# Altium schematic sheet SCH12_AFE.SchDoc: Beaglebone Black - AFE
size B; Organization: CWRUbotix; Address1: 10900 Euclid Avenue; Address2: Cleveland, OH 44106; Address3: USA; Revision: 1.0; SheetNumber: 12; SheetTotal: 13
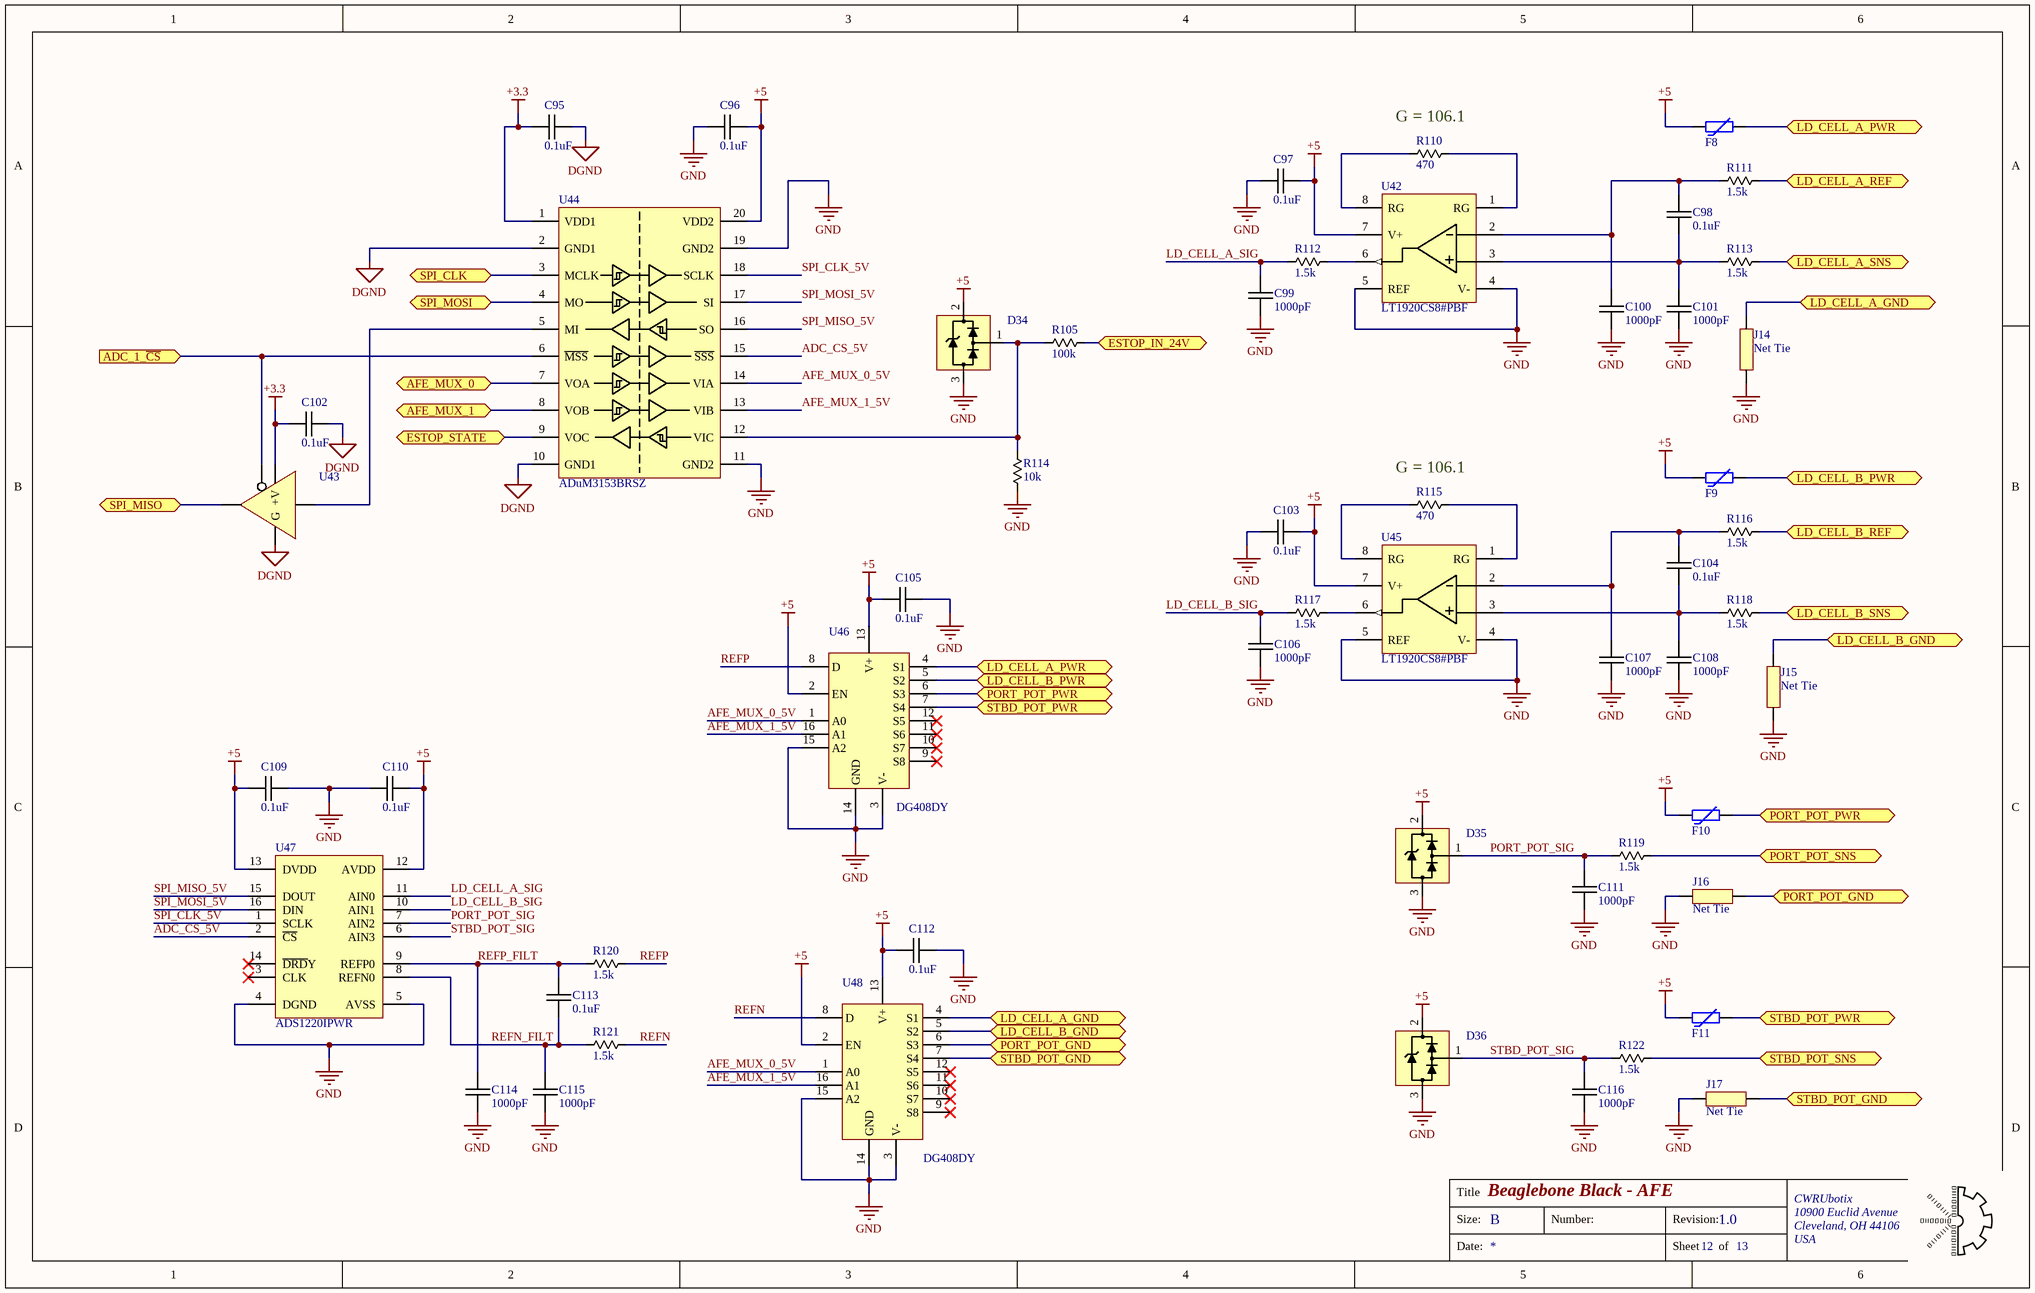
[diagram p0: SCH12_AFE.SchDoc]

## Parts
C95  0.1uF  [chip_0603]
C96  0.1uF  [chip_0603]
C97  0.1uF  [chip_0603]
C98  0.1uF  [chip_0603]
C99  1000pF  [chip_0603]
C100  1000pF  [chip_0603]
C101  1000pF  [chip_0603]
C102  0.1uF  [chip_0603]
C103  0.1uF  [chip_0603]
C104  0.1uF  [chip_0603]
C105  0.1uF  [chip_0603]
C106  1000pF  [chip_0603]
C107  1000pF  [chip_0603]
C108  1000pF  [chip_0603]
C109  0.1uF  [chip_0603]
C110  0.1uF  [chip_0603]
C111  1000pF  [chip_0603]
C112  0.1uF  [chip_0603]
C113  0.1uF  [chip_0603]
C114  1000pF  [chip_0603]
C115  1000pF  [chip_0603]
C116  1000pF  [chip_0603]
D34  DLPT05  [sot-23-3]  (value not drawn)
D35  DLPT05  [sot-23-3]  (value not drawn)
D36  DLPT05  [sot-23-3]  (value not drawn)
F8  PTC_0  [chip_1206]  (value not drawn)
F9  PTC_0  [chip_1206]  (value not drawn)
F10  PTC_0  [chip_1206]  (value not drawn)
F11  PTC_0  [chip_1206]  (value not drawn)
J14  Net Tie  [net_tie_0]
J15  Net Tie  [net_tie_0]
J16  Net Tie  [net_tie_0]
J17  Net Tie  [net_tie_0]
R105  100k  [chip_0603]
R110  470  [chip_0805]
R111  1.5k  [chip_0603]
R112  1.5k  [chip_0603]
R113  1.5k  [chip_0603]
R114  10k  [chip_0603]
R115  470  [chip_0805]
R116  1.5k  [chip_0603]
R117  1.5k  [chip_0603]
R118  1.5k  [chip_0603]
R119  1.5k  [chip_0603]
R120  1.5k  [chip_0603]
R121  1.5k  [chip_0603]
R122  1.5k  [chip_0603]
U42  LT1920CS8#PBF  [SO-8_1]
U43  SN74AHCT1G125  [sot-23-5]  (value not drawn)
U44  ADuM3153BRSZ  [tssop-20_1]
U45  LT1920CS8#PBF  [SO-8_1]
U46  DG408DY  [SO-16_1]
U47  ADS1220IPWR  [TSSOP-16_0_1]
U48  DG408DY  [SO-16_1]

## Ports
ADC_1_~{CS} (in), AFE_MUX_0 (bidir), AFE_MUX_1 (bidir), ESTOP_IN_24V (bidir), ESTOP_STATE (bidir), LD_CELL_A_GND (bidir), LD_CELL_A_PWR (bidir), LD_CELL_A_REF (bidir), LD_CELL_A_SNS (bidir), LD_CELL_B_GND (bidir), LD_CELL_B_PWR (bidir), LD_CELL_B_REF (bidir), LD_CELL_B_SNS (bidir), PORT_POT_GND (bidir), PORT_POT_PWR (bidir), PORT_POT_SNS (bidir), SPI_CLK (bidir), SPI_MISO (bidir), SPI_MOSI (bidir), STBD_POT_GND (bidir), STBD_POT_PWR (bidir), STBD_POT_SNS (bidir)

## Nets
+3.3: C95.2 C102.2 U43.5(+V) U44.1(VDD1)
+5: C96.1 C97.1 C103.1 C105.2 C109.2 C110.1 C112.2 D34.2(VCC) D35.2(VCC) D36.2(VCC) F8.1 F9.1 F10.1 F11.1 U42.7(V+) U44.20(VDD2) U45.7(V+) U46.2(EN) U46.13(V+) U47.12(AVDD) U47.13(DVDD) U48.2(EN) U48.13(V+)
DGND: C95.1 C102.1 U43.3(G) U44.2(GND1) U44.10(GND1)
GND: C96.2 C97.2 C99.2 C100.2 C101.2 C103.2 C105.1 C106.2 C107.2 C108.2 C109.1 C110.2 C111.2 C112.1 C114.2 C115.2 C116.2 D34.3(GND) D35.3(GND) D36.3(GND) J14.1(NET1) J15.1(NET1) J16.1(NET1) J17.1(NET1) R114.2 U42.4(V-) U42.5(REF) U44.11(GND2) U44.19(GND2) U45.4(V-) U45.5(REF) U46.3(V-) U46.14(GND) U46.15(A2) U47.4(DGND) U47.5(AVSS) U48.3(V-) U48.14(GND) U48.15(A2)
ADC_1_~{CS}: U43.1(~{OE}) U44.6(~{MSS}) ; port ADC_1_~{CS}
ADC_CS_5V: U44.15(~{SSS}) U47.2(~{CS})
AFE_MUX_0: U44.7(VOA) ; port AFE_MUX_0
AFE_MUX_0_5V: U44.14(VIA) U46.1(A0) U48.1(A0)
AFE_MUX_1: U44.8(VOB) ; port AFE_MUX_1
AFE_MUX_1_5V: U44.13(VIB) U46.16(A1) U48.16(A1)
ESTOP_IN_24V: R105.2 ; port ESTOP_IN_24V
ESTOP_STATE: U44.9(VOC) ; port ESTOP_STATE
LD_CELL_A_GND: J14.2(NET2) U48.4(S1) ; port LD_CELL_A_GND
LD_CELL_A_PWR: F8.2 U46.4(S1) ; port LD_CELL_A_PWR
LD_CELL_A_REF: R111.2 ; port LD_CELL_A_REF
LD_CELL_A_SIG: C99.1 R112.1 U47.11(AIN0)
LD_CELL_A_SNS: R113.2 ; port LD_CELL_A_SNS
LD_CELL_B_GND: J15.2(NET2) U48.5(S2) ; port LD_CELL_B_GND
LD_CELL_B_PWR: F9.2 U46.5(S2) ; port LD_CELL_B_PWR
LD_CELL_B_REF: R116.2 ; port LD_CELL_B_REF
LD_CELL_B_SIG: C106.1 R117.1 U47.10(AIN1)
LD_CELL_B_SNS: R118.2 ; port LD_CELL_B_SNS
PORT_POT_GND: J16.2(NET2) U48.6(S3) ; port PORT_POT_GND
PORT_POT_PWR: F10.2 U46.6(S3) ; port PORT_POT_PWR
PORT_POT_SIG: C111.1 D35.1(LINE) R119.1 U47.7(AIN2)
PORT_POT_SNS: R119.2 ; port PORT_POT_SNS
REFN: R121.2 U48.8(D)
REFN_FILT: C113.2 C115.1 R121.1 U47.8(REFN0)
REFP: R120.2 U46.8(D)
REFP_FILT: C113.1 C114.1 R120.1 U47.9(REFP0)
SPI_CLK: U44.3(MCLK) ; port SPI_CLK
SPI_CLK_5V: U44.18(SCLK) U47.1(SCLK)
SPI_MISO: U43.4(Y) ; port SPI_MISO
SPI_MISO_5V: U44.16(SO) U47.15(DOUT)
SPI_MOSI: U44.4(MO) ; port SPI_MOSI
SPI_MOSI_5V: U44.17(SI) U47.16(DIN)
STBD_POT_GND: J17.2(NET2) U48.7(S4) ; port STBD_POT_GND
STBD_POT_PWR: F11.2 U46.7(S4) ; port STBD_POT_PWR
STBD_POT_SIG: C116.1 D36.1(LINE) R122.1 U47.6(AIN3)
STBD_POT_SNS: R122.2 ; port STBD_POT_SNS
NetC98_1: C98.1 C100.1 R111.1 U42.2(-IN)
NetC98_2: C98.2 C101.1 R113.1 U42.3(+IN)
NetC104_1: C104.1 C107.1 R116.1 U45.2(-IN)
NetC104_2: C104.2 C108.1 R118.1 U45.3(+IN)
NetD34_1: D34.1(LINE) R105.1 R114.1 U44.12(VIC)
NetR110_1: R110.1 U42.8(RG)
NetR110_2: R110.2 U42.1(RG)
NetR112_2: R112.2 U42.6(OUT)
NetR115_1: R115.1 U45.8(RG)
NetR115_2: R115.2 U45.1(RG)
NetR117_2: R117.2 U45.6(OUT)
NetU43_2: U43.2(A) U44.5(MI)

Not connected (* = marked no-connect by the designer): U46 9(S8)* 10(S7)* 11(S6)* 12(S5)*; U47 3(CLK)* 14(~{DRD}Y)*; U48 9(S8)* 10(S7)* 11(S6)* 12(S5)*

## Notes on the sheet
- (near R110) G = 106.1
- (near R115) G = 106.1
- Title
- Size:
- B
- Number:
- Revision:
- Date:
- Sheet
- of

## Library data of the parts
C95-C98 C102-C105 C109 C110 C112 C113 = CAP-00542: CAP, 0.1uF, ±10%, 16V, X7R, 0603; Manufacturer: Murata; Part Number: CAP-00542; Capacitance: 0.1uF; Tolerance: ±10%; Voltage Rating: 16V; Type: X7R
C99-C101 C106-C108 C111 C114-C116 = CAP-00457: CAP, 1000pF, ±1%, 50V, C0G, 0603; Manufacturer: Murata; Manufacturer PN: GRM1885C1H102FA01D; Part Number: CAP-00457; Capacitance: 1000pF; Tolerance: ±1%; Voltage Rating: 50V; Type: C0G
D34-D36 = DIO-00057: TVS, Steering (Rail-Rail), 9.8V Clamping, 17A Peak Pulse, SOT-23; Manufacturer: Diodes Incorporated; Manufacturer PN: DLPT05-7-F; Reverse Breakdown Voltage: 6.0V; Part Number: DIO-00057; Type: TVS; Cost: 0.38
F8-F11 = MISC-00008: PTC Resettable fuse, 6V, 500mA, 1206; Manufacturer: Eaton; Manufacturer PN: PTS12066V050; Part Number: MISC-00008; Cost: 0.3
J14-J17 = MISC-00039: Part Number: MISC-00039
R105 = RES-00301: RES SMD 100K OHM 1% 1/4W 0603; Manufacturer: Panasonic; Manufacturer PN: ERJ-PA3F1003V; Power Rating: 0.25W; Part Number: RES-00301; Resistance: 100k; Tolerance: 1%
R110 R115 = RES-00237: RES SMD 470 OHM 1% 1/8W 0805; Manufacturer: Rohm Semiconductor; Manufacturer PN: KTR10EZPF4700; Power Rating: 0.125W; Part Number: RES-00237; Resistance: 470; Tolerance: 1%
R111-R113 R116-R122 = RES-00284: RES SMD 1.5K OHM 1% 1/4W 0603; Manufacturer: Panasonic; Manufacturer PN: ERJ-PA3F1501V; Power Rating: 0.25W; Part Number: RES-00284; Resistance: 1.5k; Tolerance: 1%
R114 = RES-00306: RES SMD 10K OHM 1% 1/4W 0603; Manufacturer: Panasonic; Manufacturer PN: ERJ-PA3F1002V; Power Rating: 0.25W; Part Number: RES-00306; Resistance: 10k; Tolerance: 1%; Cost: 0.144
U42 U45 = ANLG-00071: IC, Instrumentation Amp, Single, 4.6 ~ 36V supply, SOIC-8; Manufacturer: Linear Technology; Part Number: ANLG-00071; Manufacturer PN: LT1920CS8#PBF; Cost: 7.61
U43 = LOGIC-00027: Tri-State Buffer, Single, 2-5.5V, SOT-23-5, SN74AHC1G125; Manufacturer: TI; Manufacturer PN: SN74AHC1G125DBVR; Part Number: LOGIC-00027; Cost: $0.33
U44 = IFACE-00029: Digital Isolator, SPI-bus optomized, ADuM3151; Manufacturer: Analog Devices; Part Number: IFACE-00029; Manufacturer PN: ADuM3153BRSZ; Cost: 6.69
U46 U48 = ANLG-00072: Analog Mux, 8:1, 5 ~ 36V, SOIC-16; Manufacturer: Vishay; Part Number: ANLG-00072; Manufacturer PN: DG408DY; Cost: 1.77
U47 = ANLG-00073: IC, ADC 24-bit 4-Channel MUX-PGA, Sigma-Delta, 2k SPS, 16-TSSOP; Manufacturer: TI; Part Number: ANLG-00073; Manufacturer PN: ADS1220IPWR; Cost: 8.27